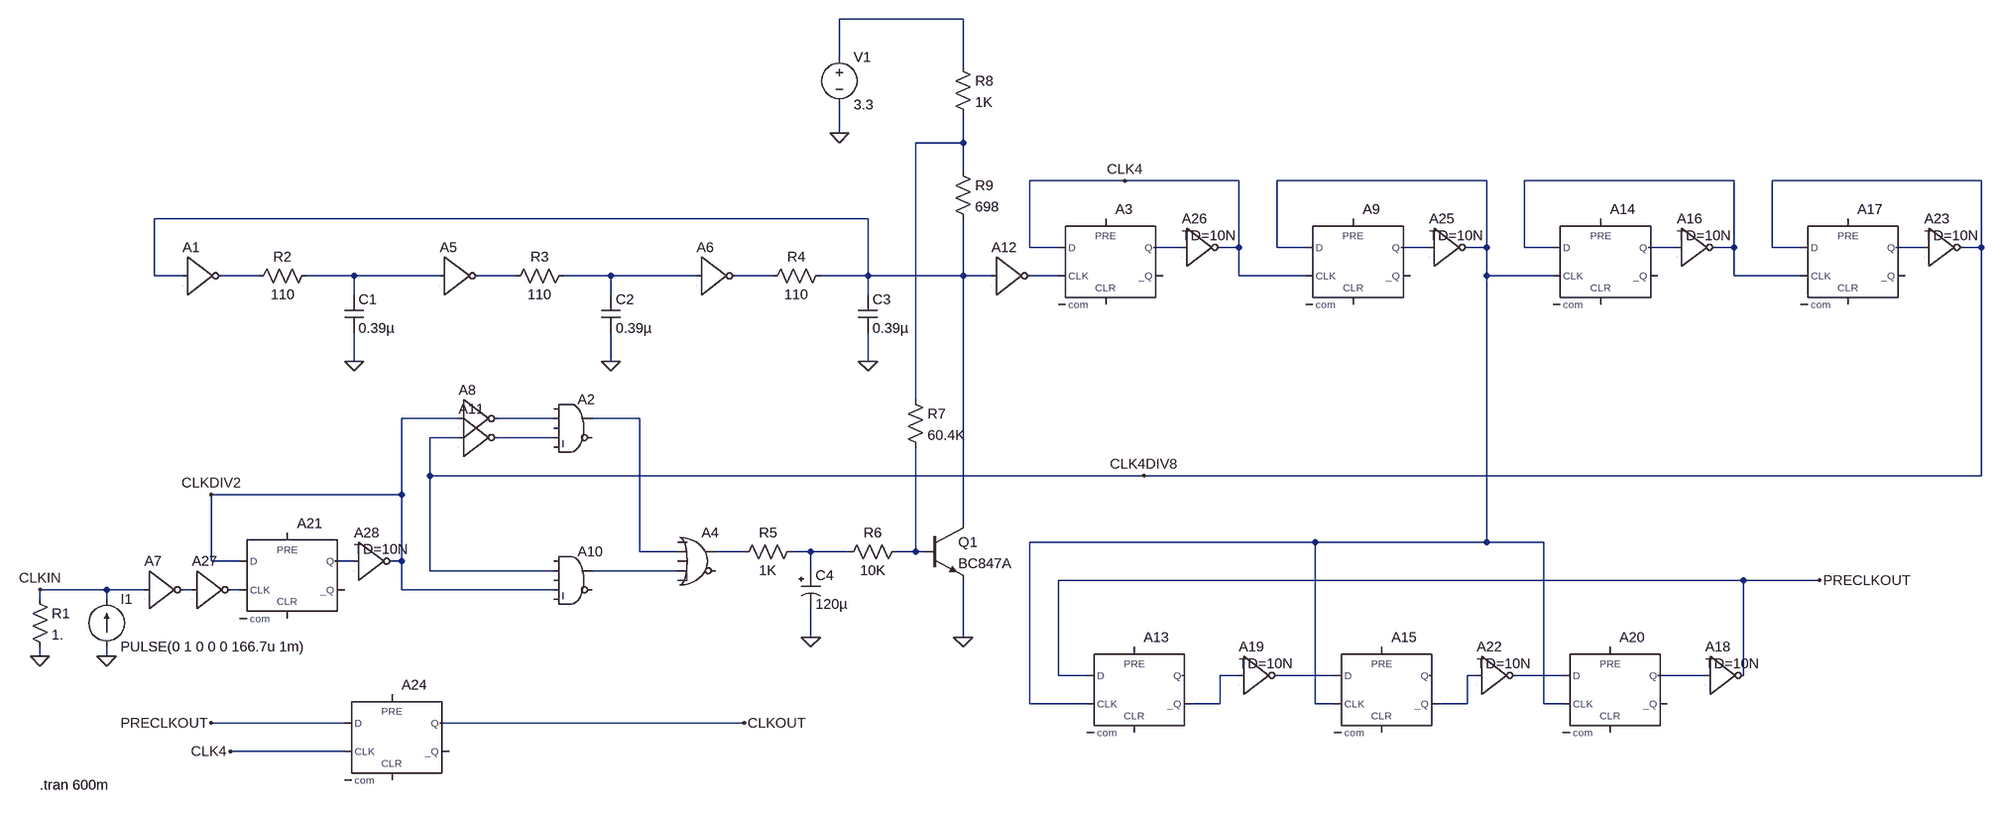
[diagram p0: schematic clock_freq_divided_by_3.asc]
clock_freq_divided_by_3.asc, the LTspice schematic file:
Version 4
SHEET 1 3124 696
WIRE 1088 -704 880 -704
WIRE 880 -640 880 -704
WIRE 1088 -624 1088 -704
WIRE 880 -512 880 -560
WIRE 1088 -496 1088 -544
WIRE 1088 -496 1008 -496
WIRE 1088 -448 1088 -496
WIRE 1360 -432 1200 -432
WIRE 1552 -432 1360 -432
WIRE 1968 -432 1616 -432
WIRE 2384 -432 2032 -432
WIRE 2800 -432 2448 -432
WIRE 928 -368 -272 -368
WIRE 1200 -320 1200 -432
WIRE 1248 -320 1200 -320
WIRE 1456 -320 1408 -320
WIRE 1552 -320 1552 -432
WIRE 1552 -320 1520 -320
WIRE 1616 -320 1616 -432
WIRE 1664 -320 1616 -320
WIRE 1872 -320 1824 -320
WIRE 1968 -320 1968 -432
WIRE 1968 -320 1936 -320
WIRE 2032 -320 2032 -432
WIRE 2080 -320 2032 -320
WIRE 2288 -320 2240 -320
WIRE 2384 -320 2384 -432
WIRE 2384 -320 2352 -320
WIRE 2448 -320 2448 -432
WIRE 2496 -320 2448 -320
WIRE 2704 -320 2656 -320
WIRE 2800 -320 2800 -432
WIRE 2800 -320 2768 -320
WIRE -272 -272 -272 -368
WIRE -224 -272 -272 -272
WIRE -96 -272 -160 -272
WIRE 64 -272 -16 -272
WIRE 208 -272 64 -272
WIRE 336 -272 272 -272
WIRE 496 -272 416 -272
WIRE 640 -272 496 -272
WIRE 768 -272 704 -272
WIRE 928 -272 928 -368
WIRE 928 -272 848 -272
WIRE 1088 -272 1088 -368
WIRE 1088 -272 928 -272
WIRE 1136 -272 1088 -272
WIRE 1248 -272 1200 -272
WIRE 1552 -272 1552 -320
WIRE 1664 -272 1552 -272
WIRE 1968 -272 1968 -320
WIRE 2080 -272 1968 -272
WIRE 2384 -272 2384 -320
WIRE 2496 -272 2384 -272
WIRE 64 -240 64 -272
WIRE 496 -240 496 -272
WIRE 928 -240 928 -272
WIRE 64 -128 64 -176
WIRE 496 -128 496 -176
WIRE 928 -128 928 -176
WIRE 1008 -64 1008 -496
WIRE 240 -32 144 -32
WIRE 400 -32 304 -32
WIRE 544 -32 464 -32
WIRE 240 0 192 0
WIRE 400 0 304 0
WIRE 192 64 192 0
WIRE 1392 64 192 64
WIRE 2800 64 2800 -320
WIRE 2800 64 1392 64
WIRE 144 96 144 -32
WIRE 144 96 -176 96
WIRE 1088 144 1088 -272
WIRE 1680 176 1200 176
WIRE 1968 176 1968 -272
WIRE 1968 176 1680 176
WIRE 2064 176 1968 176
WIRE 544 192 544 -32
WIRE 608 192 544 192
WIRE 720 192 672 192
WIRE 832 192 800 192
WIRE 896 192 832 192
WIRE 1008 192 1008 16
WIRE 1008 192 976 192
WIRE 1024 192 1008 192
WIRE -176 208 -176 96
WIRE -128 208 -176 208
WIRE 64 208 32 208
WIRE 144 208 144 96
WIRE 144 208 128 208
WIRE 192 224 192 64
WIRE 400 224 192 224
WIRE 608 224 464 224
WIRE 832 224 832 192
WIRE 2400 240 1248 240
WIRE 2528 240 2400 240
WIRE -352 256 -464 256
WIRE -288 256 -352 256
WIRE -208 256 -224 256
WIRE -128 256 -144 256
WIRE 144 256 144 208
WIRE 400 256 144 256
WIRE -464 272 -464 256
WIRE -352 272 -352 256
WIRE 832 336 832 288
WIRE 1088 336 1088 240
WIRE -464 368 -464 352
WIRE -352 368 -352 352
WIRE 1248 400 1248 240
WIRE 1296 400 1248 400
WIRE 1552 400 1520 400
WIRE 1712 400 1616 400
WIRE 1952 400 1936 400
WIRE 2096 400 2016 400
WIRE 2336 400 2256 400
WIRE 2400 400 2400 240
WIRE 1200 448 1200 176
WIRE 1296 448 1200 448
WIRE 1520 448 1520 400
WIRE 1520 448 1472 448
WIRE 1680 448 1680 176
WIRE 1712 448 1680 448
WIRE 1936 448 1936 400
WIRE 1936 448 1888 448
WIRE 2064 448 2064 176
WIRE 2096 448 2064 448
WIRE 48 480 -176 480
WIRE 720 480 208 480
WIRE 48 528 -144 528
FLAG -464 368 0
FLAG -352 368 0
FLAG -464 256 CLKIN
FLAG 64 -128 0
FLAG 496 -128 0
FLAG 928 -128 0
FLAG 832 336 0
FLAG 1088 336 0
FLAG 1360 -432 CLK4
FLAG 2528 240 PRECLKOUT
FLAG 880 -512 0
FLAG -176 96 CLKDIV2
FLAG 1392 64 CLK4DIV8
FLAG 720 480 CLKOUT
FLAG -176 480 PRECLKOUT
FLAG -144 528 CLK4
SYMBOL DIGITAL\\INV -224 -336 R0
WINDOW 0 0 16 Left 2
WINDOW 3 -16 96 Left 2
SYMATTR InstName A1
SYMBOL DIGITAL\\AND 432 -80 R0
SYMATTR InstName A2
SYMBOL DIGITAL\\DFLOP 1328 -368 R0
WINDOW 0 16 -16 Left 2
WINDOW 3 16 160 Left 2
SYMATTR InstName A3
SYMBOL CURRENT -352 352 M180
WINDOW 0 24 80 Left 2
WINDOW 3 24 0 Left 2
WINDOW 123 0 0 Left 2
WINDOW 39 0 0 Left 2
SYMATTR InstName I1
SYMATTR Value PULSE(0 1 0 0 0 166.7u 1m)
SYMBOL RES -480 256 R0
SYMATTR InstName R1
SYMATTR Value 1.
SYMBOL Digital\\or 640 144 R0
SYMATTR InstName A4
SYMBOL res 0 -288 R90
WINDOW 0 0 56 VBottom 2
WINDOW 3 32 56 VTop 2
SYMATTR InstName R2
SYMATTR Value 110
SYMATTR SpiceLine tol=1 pwr=0.1
SYMBOL cap 48 -240 R0
SYMATTR InstName C1
SYMATTR Value 0.39µ
SYMBOL DIGITAL\\INV 208 -336 R0
WINDOW 0 0 16 Left 2
WINDOW 3 -16 96 Left 2
SYMATTR InstName A5
SYMBOL res 432 -288 R90
WINDOW 0 0 56 VBottom 2
WINDOW 3 32 56 VTop 2
SYMATTR InstName R3
SYMATTR Value 110
SYMATTR SpiceLine tol=1 pwr=0.1
SYMBOL DIGITAL\\INV 640 -336 R0
WINDOW 0 0 16 Left 2
WINDOW 3 -16 96 Left 2
SYMATTR InstName A6
SYMBOL res 864 -288 R90
WINDOW 0 0 56 VBottom 2
WINDOW 3 32 56 VTop 2
SYMATTR InstName R4
SYMATTR Value 110
SYMATTR SpiceLine tol=1 pwr=0.1
SYMBOL DIGITAL\\INV -288 192 R0
WINDOW 0 0 16 Left 2
WINDOW 3 -16 96 Left 2
SYMATTR InstName A7
SYMBOL DIGITAL\\INV 240 -96 R0
WINDOW 0 0 16 Left 2
WINDOW 3 -16 96 Left 2
SYMATTR InstName A8
SYMBOL DIGITAL\\DFLOP 1744 -368 R0
WINDOW 0 16 -16 Left 2
WINDOW 3 16 160 Left 2
SYMATTR InstName A9
SYMBOL DIGITAL\\AND 432 176 R0
SYMATTR InstName A10
SYMBOL DIGITAL\\INV 240 -64 R0
WINDOW 0 0 16 Left 2
WINDOW 3 -16 96 Left 2
SYMATTR InstName A11
SYMBOL res 816 176 R90
WINDOW 0 0 56 VBottom 2
WINDOW 3 32 56 VTop 2
SYMATTR InstName R5
SYMATTR Value 1K
SYMATTR SpiceLine tol=1 pwr=0.1
SYMBOL polcap 816 224 R0
WINDOW 3 24 56 Left 2
SYMATTR Value 120µ
SYMATTR InstName C4
SYMATTR Description Capacitor
SYMATTR Type cap
SYMBOL npn 1024 144 R0
SYMATTR InstName Q1
SYMATTR Value BC847A
SYMBOL res 992 176 R90
WINDOW 0 0 56 VBottom 2
WINDOW 3 32 56 VTop 2
SYMATTR InstName R6
SYMATTR Value 10K
SYMATTR SpiceLine tol=1 pwr=0.1
SYMBOL DIGITAL\\INV 1136 -336 R0
WINDOW 0 0 16 Left 2
WINDOW 3 -16 96 Left 2
SYMATTR InstName A12
SYMBOL res 992 -80 R0
SYMATTR InstName R7
SYMATTR Value 60.4K
SYMATTR SpiceLine tol=1 pwr=0.1
SYMBOL DIGITAL\\DFLOP 1376 352 R0
WINDOW 0 16 -16 Left 2
WINDOW 3 16 160 Left 2
SYMATTR InstName A13
SYMBOL DIGITAL\\DFLOP 1792 352 R0
WINDOW 0 16 -16 Left 2
WINDOW 3 16 160 Left 2
SYMATTR InstName A15
SYMBOL DIGITAL\\DFLOP 2176 352 R0
WINDOW 0 16 -16 Left 2
WINDOW 3 16 160 Left 2
SYMATTR InstName A20
SYMBOL voltage 880 -656 R0
WINDOW 123 0 0 Left 2
WINDOW 39 0 0 Left 2
SYMATTR InstName V1
SYMATTR Value 3.3
SYMBOL res 1072 -640 R0
SYMATTR InstName R8
SYMATTR Value 1K
SYMATTR SpiceLine tol=1 pwr=0.1
SYMBOL res 1072 -464 R0
SYMATTR InstName R9
SYMATTR Value 698
SYMATTR SpiceLine tol=1 pwr=0.1
SYMBOL DIGITAL\\INV 1552 336 R0
WINDOW 0 0 16 Left 2
WINDOW 3 0 44 Left 2
SYMATTR InstName A19
SYMATTR Value TD=10N
SYMBOL DIGITAL\\INV 1952 336 R0
WINDOW 0 0 16 Left 2
WINDOW 3 0 44 Left 2
SYMATTR InstName A22
SYMATTR Value TD=10N
SYMBOL DIGITAL\\INV 2336 336 R0
WINDOW 0 0 16 Left 2
WINDOW 3 0 44 Left 2
SYMATTR InstName A18
SYMATTR Value TD=10N
SYMBOL cap 480 -240 R0
SYMATTR InstName C2
SYMATTR Value 0.39µ
SYMBOL cap 912 -240 R0
SYMATTR InstName C3
SYMATTR Value 0.39µ
SYMBOL DIGITAL\\DFLOP -48 160 R0
WINDOW 0 16 -16 Left 2
WINDOW 3 16 160 Left 2
SYMATTR InstName A21
SYMBOL DIGITAL\\INV 1872 -384 R0
WINDOW 0 0 16 Left 2
WINDOW 3 0 44 Left 2
SYMATTR InstName A25
SYMATTR Value TD=10N
SYMBOL DIGITAL\\INV 1456 -384 R0
WINDOW 0 0 16 Left 2
WINDOW 3 0 44 Left 2
SYMATTR InstName A26
SYMATTR Value TD=10N
SYMBOL DIGITAL\\INV -208 192 R0
WINDOW 0 0 16 Left 2
WINDOW 3 -16 96 Left 2
SYMATTR InstName A27
SYMBOL DIGITAL\\INV 64 144 R0
WINDOW 0 0 16 Left 2
WINDOW 3 0 44 Left 2
SYMATTR InstName A28
SYMATTR Value TD=10N
SYMBOL DIGITAL\\DFLOP 2160 -368 R0
WINDOW 0 16 -16 Left 2
WINDOW 3 16 160 Left 2
SYMATTR InstName A14
SYMBOL DIGITAL\\INV 2288 -384 R0
WINDOW 0 0 16 Left 2
WINDOW 3 0 44 Left 2
SYMATTR InstName A16
SYMATTR Value TD=10N
SYMBOL DIGITAL\\DFLOP 2576 -368 R0
WINDOW 0 16 -16 Left 2
WINDOW 3 16 160 Left 2
SYMATTR InstName A17
SYMBOL DIGITAL\\INV 2704 -384 R0
WINDOW 0 0 16 Left 2
WINDOW 3 0 44 Left 2
SYMATTR InstName A23
SYMATTR Value TD=10N
SYMBOL DIGITAL\\DFLOP 128 432 R0
WINDOW 0 16 -16 Left 2
WINDOW 3 16 160 Left 2
SYMATTR InstName A24
TEXT -464 584 Left 2 !.tran 600m

The netlist it stands for:
* clock_freq_divided_by_3.asc
A1 N005 0 0 0 0 N010 0 0 BUF
A2 0 N016 0 N018 0 0 N017 0 AND
A3 CLK4 0 N015 0 0 0 N006 0 DFLOP
I1 0 CLKIN PULSE(0 1 0 0 0 166.7u 1m)
R1 CLKIN 0 1.
A4 0 N017 0 N023 0 0 N019 0 OR
R2 N011 N010 110 tol=1 pwr=0.1
C1 N011 0 0.39µ
A5 N011 0 0 0 0 N012 0 0 BUF
R3 N013 N012 110 tol=1 pwr=0.1
A6 N013 0 0 0 0 N014 0 0 BUF
R4 N005 N014 110 tol=1 pwr=0.1
A7 CLKIN 0 0 0 0 N024 0 0 BUF
A8 CLKDIV2 0 0 0 0 N016 0 0 BUF
A9 N003 0 CLK4 0 0 0 N007 0 DFLOP
A10 0 CLK4DIV8 0 CLKDIV2 0 0 N023 0 AND
A11 CLK4DIV8 0 0 0 0 N018 0 0 BUF
R5 N020 N019 1K tol=1 pwr=0.1
C4 N020 0 120µ
Q1 N005 N021 0 0 BC847A
R6 N021 N020 10K tol=1 pwr=0.1
A12 N005 0 0 0 0 N015 0 0 BUF
R7 N002 N021 60.4K tol=1 pwr=0.1
A13 PRECLKOUT 0 N003 0 0 N026 0 0 DFLOP
A15 N027 0 N003 0 0 N028 0 0 DFLOP
A20 N029 0 N003 0 0 0 N030 0 DFLOP
V1 N001 0 3.3
R8 N001 N002 1K tol=1 pwr=0.1
R9 N002 N005 698 tol=1 pwr=0.1
A19 N026 0 0 0 0 N027 0 0 BUF TD=10N
A22 N028 0 0 0 0 N029 0 0 BUF TD=10N
A18 N030 0 0 0 0 PRECLKOUT 0 0 BUF TD=10N
C2 N013 0 0.39µ
C3 N005 0 0.39µ
A21 CLKDIV2 0 N025 0 0 0 N022 0 DFLOP
A25 N007 0 0 0 0 N003 0 0 BUF TD=10N
A26 N006 0 0 0 0 CLK4 0 0 BUF TD=10N
A27 N024 0 0 0 0 N025 0 0 BUF
A28 N022 0 0 0 0 CLKDIV2 0 0 BUF TD=10N
A14 N004 0 N003 0 0 0 N008 0 DFLOP
A16 N008 0 0 0 0 N004 0 0 BUF TD=10N
A17 CLK4DIV8 0 N004 0 0 0 N009 0 DFLOP
A23 N009 0 0 0 0 CLK4DIV8 0 0 BUF TD=10N
A24 PRECLKOUT 0 CLK4 0 0 0 CLKOUT 0 DFLOP
.model NPN NPN
.model PNP PNP
.lib standard.bjt
.tran 600m
.backanno
.end